# EAGLE schematic Revised (EAGLE 8.2.1)
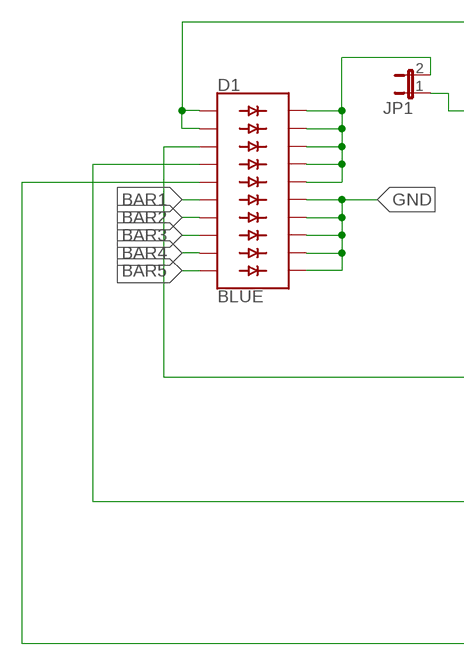
[diagram p0: schematic, sheet 1, part 1 of 2]
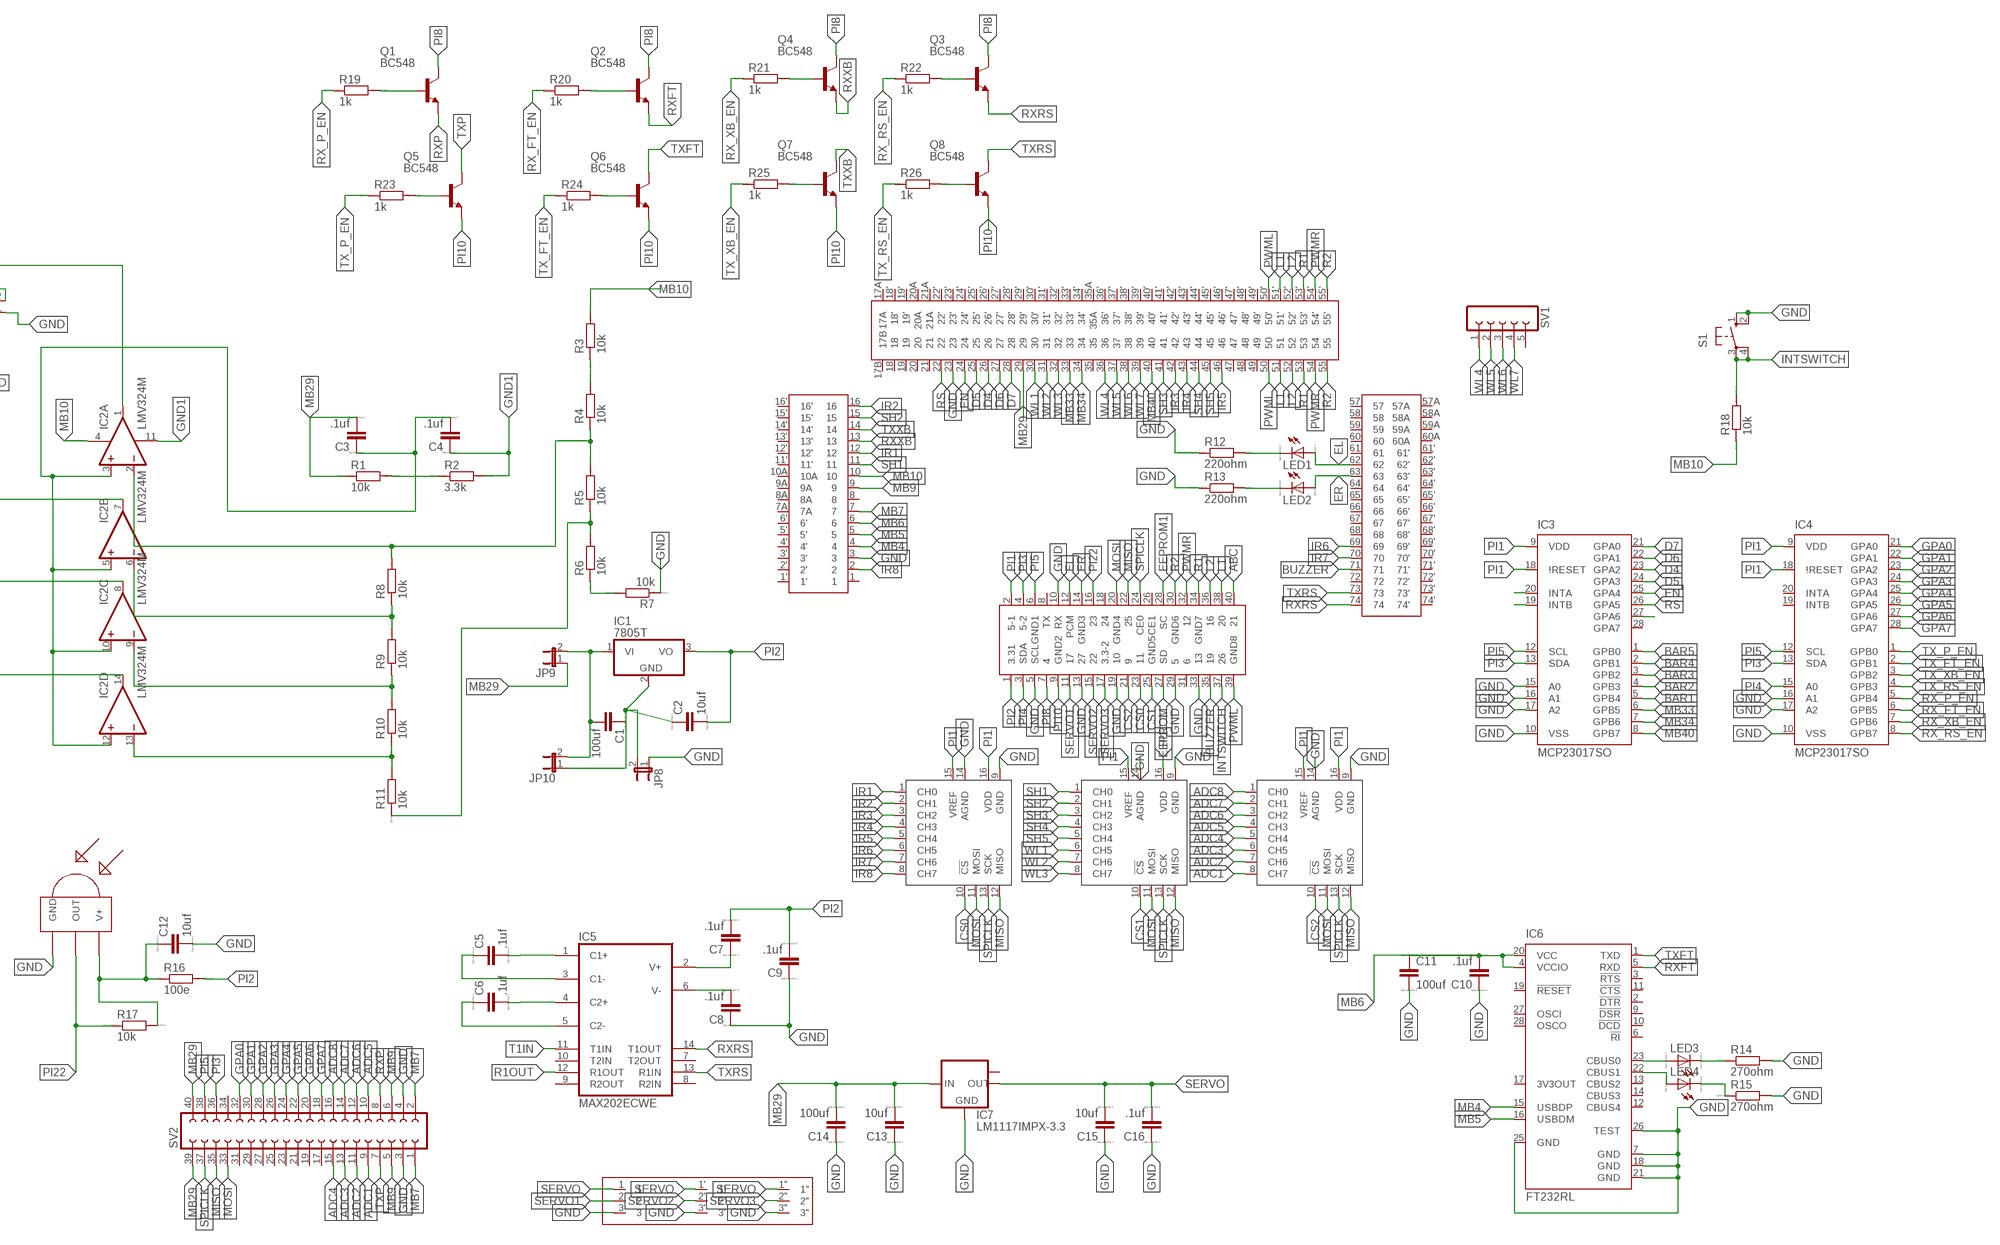
[diagram p1: schematic, sheet 1, part 2 of 2]

## Parts
C1  100uf  CC1206  [C1206]
C2  10uf  CC1206  [C1206]
C3  .1uf  CC1206  [C1206]
C4  .1uf  CC1206  [C1206]
C5  .1uf  CC1206  [C1206]
C6  .1uf  CC1206  [C1206]
C7  .1uf  CC1206  [C1206]
C8  .1uf  CC1206  [C1206]
C9  .1uf  CC1206  [C1206]
C10  .1uf  CC1206  [C1206]
C11  100uf  CC1206  [C1206]
C12  10uf  CC1206  [C1206]
C13  10uf  CC1206  [C1206]
C14  100uf  CC1206  [C1206]
C15  10uf  CC1206  [C1206]
C16  .1uf  CC1206  [C1206]
D1  BLUE  LED_BARGRAPH_10BLUE  [LED_BARGRAPH_10]
IC1  7805T  [TO220H]
IC2  LMV324M  [SO14]
IC3  MCP23017SO  [SO28W]
IC4  MCP23017SO  [SO28W]
IC5  MAX202ECWE  [SO16L]
IC6  FT232RL  [SSOP28]
IC7  LM1117IMPX-3.3  [SOT223]
JP1  JP1E  [JP1]
JP8  JP1E  [JP1]
JP9  JP1E  [JP1]
JP10  JP1E  [JP1]
LED1  LED_E  [LED_1206]
LED2  LED_E  [LED_1206]
LED3  LED_E  [LED_1206]
LED4  LED_E  [LED_1206]
Q1  BC548  [TO92-EBC]
Q2  BC548  [TO92-EBC]
Q3  BC548  [TO92-EBC]
Q4  BC548  [TO92-EBC]
Q5  BC548  [TO92-EBC]
Q6  BC548  [TO92-EBC]
Q7  BC548  [TO92-EBC]
Q8  BC548  [TO92-EBC]
R1  10k  RR1206  [R1206]
R2  3.3k  RR1206  [R1206]
R3  10k  RR1206  [R1206]
R4  10k  RR1206  [R1206]
R5  10k  RR1206  [R1206]
R6  10k  RR1206  [R1206]
R7  10k  RR1206  [R1206]
R8  10k  RR1206  [R1206]
R9  10k  RR1206  [R1206]
R10  10k  RR1206  [R1206]
R11  10k  RR1206  [R1206]
R12  220ohm  RR1206  [R1206]
R13  220ohm  RR1206  [R1206]
R14  270ohm  RR1206  [R1206]
R15  270ohm  RR1206  [R1206]
R16  100e  RR1206  [R1206]
R17  10k  RR1206  [R1206]
R18  10k  RR1206  [R1206]
R19  1k  RR1206  [R1206]
R20  1k  RR1206  [R1206]
R21  1k  RR1206  [R1206]
R22  1k  RR1206  [R1206]
R23  1k  RR1206  [R1206]
R24  1k  RR1206  [R1206]
R25  1k  RR1206  [R1206]
R26  1k  RR1206  [R1206]
S1  10-XX  [B3F-10XX]
SV1  FE05-1  [FE05-1]
SV2  FE20-2  [FE20-2]
U$1  DAUGHTERBOARDDAUGHTERBOARD  [DAUGHTERBOARD]
U$2  MALE_HEADER  [MALE_HEADER_PACKAGE]
U$3  MCP3008SL  [SO16]
U$4  MCP3008SL  [SO16]
U$5  MCP3008SL  [SO16]
U$6  TSOP1738  [TSOP17XX]
U$7  SERVO  [SERVO]

## Nets
A: D1.16(C4) D1.17(C3) D1.18(C2) D1.19(C1) D1.20(C) JP1.2
ABC: U$2.40
ADC1: SV2.9 U$5.8(CH7)
ADC2: SV2.11 U$5.7(CH6)
ADC3: SV2.13 U$5.6(CH5)
ADC4: SV2.15 U$5.5(CH4)
ADC5: SV2.10 U$5.4(CH3)
ADC6: SV2.12 U$5.3(CH2)
ADC7: SV2.14 U$5.2(CH1)
ADC8: SV2.16 U$5.1(CH0)
BAR1: D1.6(A5) IC3.5(GPB4)
BAR2: D1.7(A6) IC3.4(GPB3)
BAR3: D1.8(A7) IC3.3(GPB2)
BAR4: D1.9(A8) IC3.2(GPB1)
BAR5: D1.10(A9) IC3.1(GPB0)
BUZZER: U$1.71 U$2.35
CS0: U$2.23 U$3.10(!CS)
CS1: U$2.25(GND5) U$4.10(!CS)
CS2: U$2.21 U$5.10(!CS)
D4: IC3.23(GPA2) U$1.26
D5: IC3.24(GPA3) U$1.25
D6: IC3.22(GPA1) U$1.27
D7: IC3.21(GPA0) U$1.28
EEPROM: U$2.27(SD)
EEPROM1: U$2.28(SC)
EL: LED1.A U$1.62 U$2.12(PCM)
EN: IC3.25(GPA4) U$1.24
ER: LED2.A U$1.63 U$2.14(GND3)
GND: C8.1 C9.1 C10.1 C11.2 C12.2 C13.1 C14.1 C15.1 C16.1 D1.11(C9) D1.12(C8) D1.13(C7) D1.14(C6) D1.15(C5) IC3.10(VSS) IC3.15(A0) IC3.16(A1) IC3.17(A2) IC4.10(VSS) IC4.16(A1) IC4.17(A2) IC6.7(GND) IC6.18(GND) IC6.21(GND) IC6.25(GND) IC6.26(TEST) IC7.1(GND) JP1.1 JP8.1 R7.1 R12.1 R13.1 R14.2 R15.2 S1.1(S) S1.2(S1) SV2.3 SV2.4 U$1.3 U$1.23 U$2.5(SCL) U$2.10(RX) U$2.13 U$2.19 U$2.29 U$2.33 U$3.9(GND) U$3.14(AGND) U$4.9(GND) U$4.14(AGND) U$5.9(GND) U$5.14(AGND) U$6.GND U$7.3 U$7.3" U$7.3'
GND1: C4.1 IC2.11(P:V-) R2.2
GPA0: IC4.21(GPA0) SV2.32
GPA1: IC4.22(GPA1) SV2.30
GPA2: IC4.23(GPA2) SV2.28
GPA3: IC4.24(GPA3) SV2.26
GPA4: IC4.25(GPA4) SV2.24
GPA5: IC4.26(GPA5) SV2.22
GPA6: IC4.27(GPA6) SV2.20
GPA7: IC4.28(GPA7) SV2.18
INTSWITCH: R18.2 S1.3(P) S1.4(P1) U$2.37
IR1: U$1.12 U$3.1(CH0)
IR2: U$1.16 U$3.2(CH1)
IR3: U$1.42 U$3.3(CH2)
IR4: U$1.43 U$3.4(CH3)
IR5: U$1.46 U$3.5(CH4)
IR6: U$1.69 U$3.6(CH5)
IR7: U$1.70 U$3.7(CH6)
IR8: U$1.2 U$3.8(CH7)
L1: U$1.51 U$1.51' U$2.38
L2: U$1.52 U$1.52' U$2.36
MB4: IC6.15(USBDP) U$1.4
MB5: IC6.16(USBDM) U$1.5
MB6: C10.2 C11.1 IC6.4(VCCIO) IC6.20(VCC) U$1.6
MB7: SV2.1 SV2.2 U$1.7
MB9: SV2.5 SV2.6 U$1.9
MB10: IC2.4(P:V+) R3.2 R18.1 U$1.10
MB29 [MB29]: C3.2 C13.2 C14.2 IC7.3(IN) JP9.1 R1.1 SV2.39 SV2.40 U$1.29
MB33: IC3.6(GPB5) U$1.33
MB34: IC3.7(GPB6) U$1.34
MB40: IC3.8(GPB7) U$1.40
MISO: SV2.35 U$2.22 U$3.12(MISO) U$4.12(MISO) U$5.12(MISO)
MOSI: SV2.33 U$2.20(GND4) U$3.11(MOSI) U$4.11(MOSI) U$5.11(MOSI)
N$1: C1.1 C2.1 IC1.2(GND) JP8.2 JP10.1
N$2: R5.1 R6.2 R11.1
N$3: C3.1 C4.2 IC2.3(A:+IN) IC2.5(B:+IN) IC2.10(C:+IN) IC2.12(D:+IN) R1.2 R2.1
N$4: R3.1 R4.2
N$5: IC2.2(A:-IN) R4.1 R5.2 R8.2
N$6: IC2.6(B:-IN) R8.1 R9.2
N$7: R6.1 R7.2
N$8: IC2.9(C:-IN) R9.1 R10.2
N$9: IC2.13(D:-IN) R10.1 R11.2
N$10: D1.1(A) D1.2(A1) IC2.1(A:OUT)
N$11: C5.1 IC5.3(C1-)
N$12: D1.4(A3) IC2.8(C:OUT)
N$13: D1.5(A4) IC2.14(D:OUT)
N$14: LED1.C R12.2
N$15: LED2.C R13.2
N$16: Q1.B R19.2
N$17: Q2.B R20.2
N$18: C5.2 IC5.1(C1+)
N$19: C6.2 IC5.4(C2+)
N$20: IC3.20(INTA)
N$21: IC3.19(INTB)
N$22: C6.1 IC5.5(C2-)
N$23: LED4.C R15.1
N$24: D1.3(A2) IC2.7(B:OUT)
N$25: LED3.C R14.1
N$26: IC6.23(CBUS0) LED3.A
N$27: IC6.22(CBUS1) LED4.A
N$28: C7.1 IC5.2(V+)
N$29: C8.2 IC5.6(V-)
N$30: Q4.B R21.2
N$31: Q3.B R22.2
N$32: C12.1 R16.1 R17.2 U$6.V+
N$33: IC3.27(GPA6)
N$38: Q8.B R26.2
N$39: Q7.B R25.2
N$40: Q6.B R24.2
N$41: Q5.B R23.2
NS50 [MB29]: C1.2 IC1.1(VI) JP9.2 JP10.2
PI1: IC3.9(VDD) IC3.18(\!RESET) IC4.9(VDD) IC4.18(\!RESET) U$2.2(5-1) U$3.15(VREF) U$3.16(VDD) U$4.15(VREF) U$4.16(VDD) U$5.15(VREF) U$5.16(VDD)
PI2: C2.2 C7.2 C9.2 IC1.3(VO) R16.2 U$2.1(3.31)
PI3: IC3.13(SDA) IC4.13(SDA) SV2.36 U$2.4(5-2)
PI4: IC4.15(A0) U$2.3(SDA)
PI5: IC3.12(SCL) IC4.12(SCL) SV2.38 U$2.6(GND1)
PI8: Q1.C Q2.C Q3.C Q4.C U$2.7
PI10: Q5.E Q6.E Q7.E Q8.E U$2.9(GND2)
PI22: R17.1 U$2.16 U$6.OUT
PWML: U$1.50 U$1.50' U$2.39(GND8)
PWMR: U$1.54 U$1.54' U$2.32
R1: U$1.53 U$1.53' U$2.34(GND7)
R1OUT: IC5.12(R1OUT)
R2: U$1.55 U$1.55' U$2.30(GND6)
RS: IC3.26(GPA5) U$1.22
RX_FT_EN: IC4.6(GPB5) R20.1
RX_P_EN: IC4.5(GPB4) R19.1
RX_RS_EN: IC4.8(GPB7) R22.1
RX_XB_EN: IC4.7(GPB6) R21.1
RXFT: IC6.5(RXD) Q2.E
RXP: Q1.E SV2.8
RXRS: IC5.14(T1OUT) Q3.E U$1.74
RXXB: Q4.E U$1.13
SERVO: C15.2 C16.2 IC7.2(OUT) U$7.1 U$7.1" U$7.1'
SERVO1: U$2.11 U$7.2
SERVO2: U$2.15 U$7.2'
SERVO3: U$2.17(3.3-2) U$7.2"
SH1: U$1.11 U$4.1(CH0)
SH2: U$1.15 U$4.2(CH1)
SH3: U$1.41 U$4.3(CH2)
SH4: U$1.44 U$4.4(CH3)
SH5: U$1.45 U$4.5(CH4)
SPICLK: SV2.37 U$2.24(CE0) U$3.13(SCK) U$4.13(SCK) U$5.13(SCK)
T1IN: IC5.11(T1IN)
TX_FT_EN: IC4.2(GPB1) R24.1
TX_P_EN: IC4.1(GPB0) R23.1
TX_RS_EN: IC4.4(GPB3) R26.1
TX_XB_EN: IC4.3(GPB2) R25.1
TXFT: IC6.1(TXD) Q6.C
TXP: Q5.C SV2.7
TXRS: IC5.13(R1IN) Q8.C U$1.73
TXXB: Q7.C U$1.14
WL1: U$1.30 U$4.6(CH5)
WL2: U$1.31 U$4.7(CH6)
WL3: U$1.32 U$4.8(CH7)
WL4: SV1.1 U$1.36
WL5: SV1.2 U$1.37
WL6: SV1.3 U$1.38
WL7: SV1.4 U$1.39
Unconnected: IC3.28(GPA7) IC4.19(INTB) IC4.20(INTA) IC5.7(T2OUT) IC5.8(R2IN) IC5.9(R2OUT) IC5.10(T2IN) IC6.2(!DTR) IC6.3(!RTS) IC6.6(!RI) IC6.9(!DSR) IC6.10(!DCD) IC6.11(!CTS) IC6.12(CBUS4) IC6.13(CBUS2) IC6.14(CBUS3) IC6.17(3V3OUT) IC6.19(!RESET) IC6.27(OSCI) IC6.28(OSCO) IC7.TAB(OUT1) SV1.5 SV2.17 SV2.19 SV2.21 SV2.23 SV2.25 SV2.27 SV2.29 SV2.31 SV2.34 U$1.1 U$1.1' U$1.2' U$1.3' U$1.4' U$1.5' U$1.6' U$1.7A U$1.8 U$1.8A U$1.9A U$1.10A U$1.11' U$1.12' U$1.13' U$1.14' U$1.15' U$1.16' U$1.17A U$1.17B U$1.18 U$1.18' U$1.19 U$1.19' U$1.20 U$1.20A U$1.21 U$1.21A U$1.22' U$1.23' U$1.24' U$1.25' U$1.26' U$1.27' U$1.28' U$1.29' U$1.30' U$1.31' U$1.32' U$1.33' U$1.34' U$1.35 U$1.35A U$1.36' U$1.37' U$1.38' U$1.39' U$1.40' U$1.41' U$1.42' U$1.43' U$1.44' U$1.45' U$1.46' U$1.47 U$1.47' U$1.48 U$1.48' U$1.49 U$1.49' U$1.57 U$1.57A U$1.58 U$1.58A U$1.59 U$1.59A U$1.60 U$1.60A U$1.61 U$1.61' U$1.62' U$1.63' U$1.64 U$1.64' U$1.65 U$1.65' U$1.66 U$1.66' U$1.67 U$1.67' U$1.68 U$1.68' U$1.69' U$1.70' U$1.71' U$1.72 U$1.72' U$1.73' U$1.74' U$2.8(TX) U$2.18 U$2.26(CE1) U$2.31

## Power pins joined to a net without a drawn wire
GND: IC5.15(GND)
VCC: IC5.16(VCC)

## Library data of the parts
C1-C16 = eagle-ltspice:C: CAPACITOR, European symbol; SPICEMODEL: NONE; SPICEPREFIX: C
D1 = SparkFun-LED:LED_BARGRAPH_10: Young Sun LED Tech - YSLB-10251G5-10 10-Segment LED Bar Graph Features: Red Vf = 2.1V, Ifmax = 20mA Yellow Vf = 2.1V, Ifmax = 20mA Blue Vf = 3.4V, Ifmax = 20mA Green Vf = 3.4V, Ifmax = 20mA SparkFun Products: Red <https://www.sparkfun.com/products/9935> Yellow <https://www.sparkfun.com/products/9936> Green <https://www.sparkfun.com/products/9938> Blue <https://www.sparkfun.com/products/9937>; PROD_ID: DIO-10613
IC1 = linear2:78*: Positive VOLTAGE REGULATOR
IC2 = linear:LMV324?*: Quad General Purpose, Low Voltage, Rail-to-Rail Output Operational Amplifiers Source: http://www.national.com/mpf/LM/LMV321.html http://www.national.com/dt/lmv_qual.pdf
IC3 IC4 = microchip-update-2:MCP23017: http://ww1.microchip.com/downloads/en/DeviceDoc/21952a.pdf Source: http://ww1.microchip.com/downloads/en/DeviceDoc/21952a.pdf
IC5 = maxim:MAX202ECWE: RS232 TRANSCEIVER; MPN: MAX202ECWE+T; OC_FARNELL: 9724419; OC_NEWARK: 67K4364
IC6 = ftdichip:FT232R: Source: http://www.ftdichip.com/Documents/DataSheets/DS_FT232R_v104.pdf; MPN: FT232RL; OC_FARNELL: 1146032; OC_NEWARK: 91K9918
IC7 = lm1117:LM1117IMPX-*
JP1 JP8-JP10 = jumper:JP1E: JUMPER
LED1-LED4 = eagle-ltspice:LED_E: LED Source: http://www.osram.convergy.de Source: www.luxeon.com Source: www.kingbright.com; SPICEMODEL: NONE; SPICEPREFIX: D; SPICETYPE: diode
Q1-Q8 = transistor-npn:BC548*: NPN Transistor
R1-R26 = eagle-ltspice:R: RESISTOR, European symbol; SPICEMODEL: NONE; SPICEPREFIX: R
S1 = switch-omron:10-XX: OMRON SWITCH; MPN: B3F-1000; OC_FARNELL: 176432; OC_NEWARK: 36M3542
SV1 = con-lsta:FE05-1: FEMALE HEADER; OC_FARNELL: unknown; OC_NEWARK: unknown
SV2 = con-lsta:FE20-2: FEMALE HEADER; OC_FARNELL: unknown; OC_NEWARK: unknown
U$1 = Daughterboard:DAUGHTERBOARD
U$2 = male_header_device:MALE_HEADER
U$3-U$5 = MCP3008:MCP3008
U$6 = tsop:TSOP1738: IR Receiver and Demodulator
U$7 = switch:SERVO

## Net classes
0 default: width 0.3 mm, clearance 0.4 mm
1 MB29: width 1 mm, clearance 0.5 mm